# EasyEDA schematic SCHEMATICS.json

## Sheets
1 schem1: TITLE: pcb_busniness card; REV: 1.0; Date: 2024-07-21; Sheet: 1/1; Drawn By: ministermonkeya1; Company: Your Company
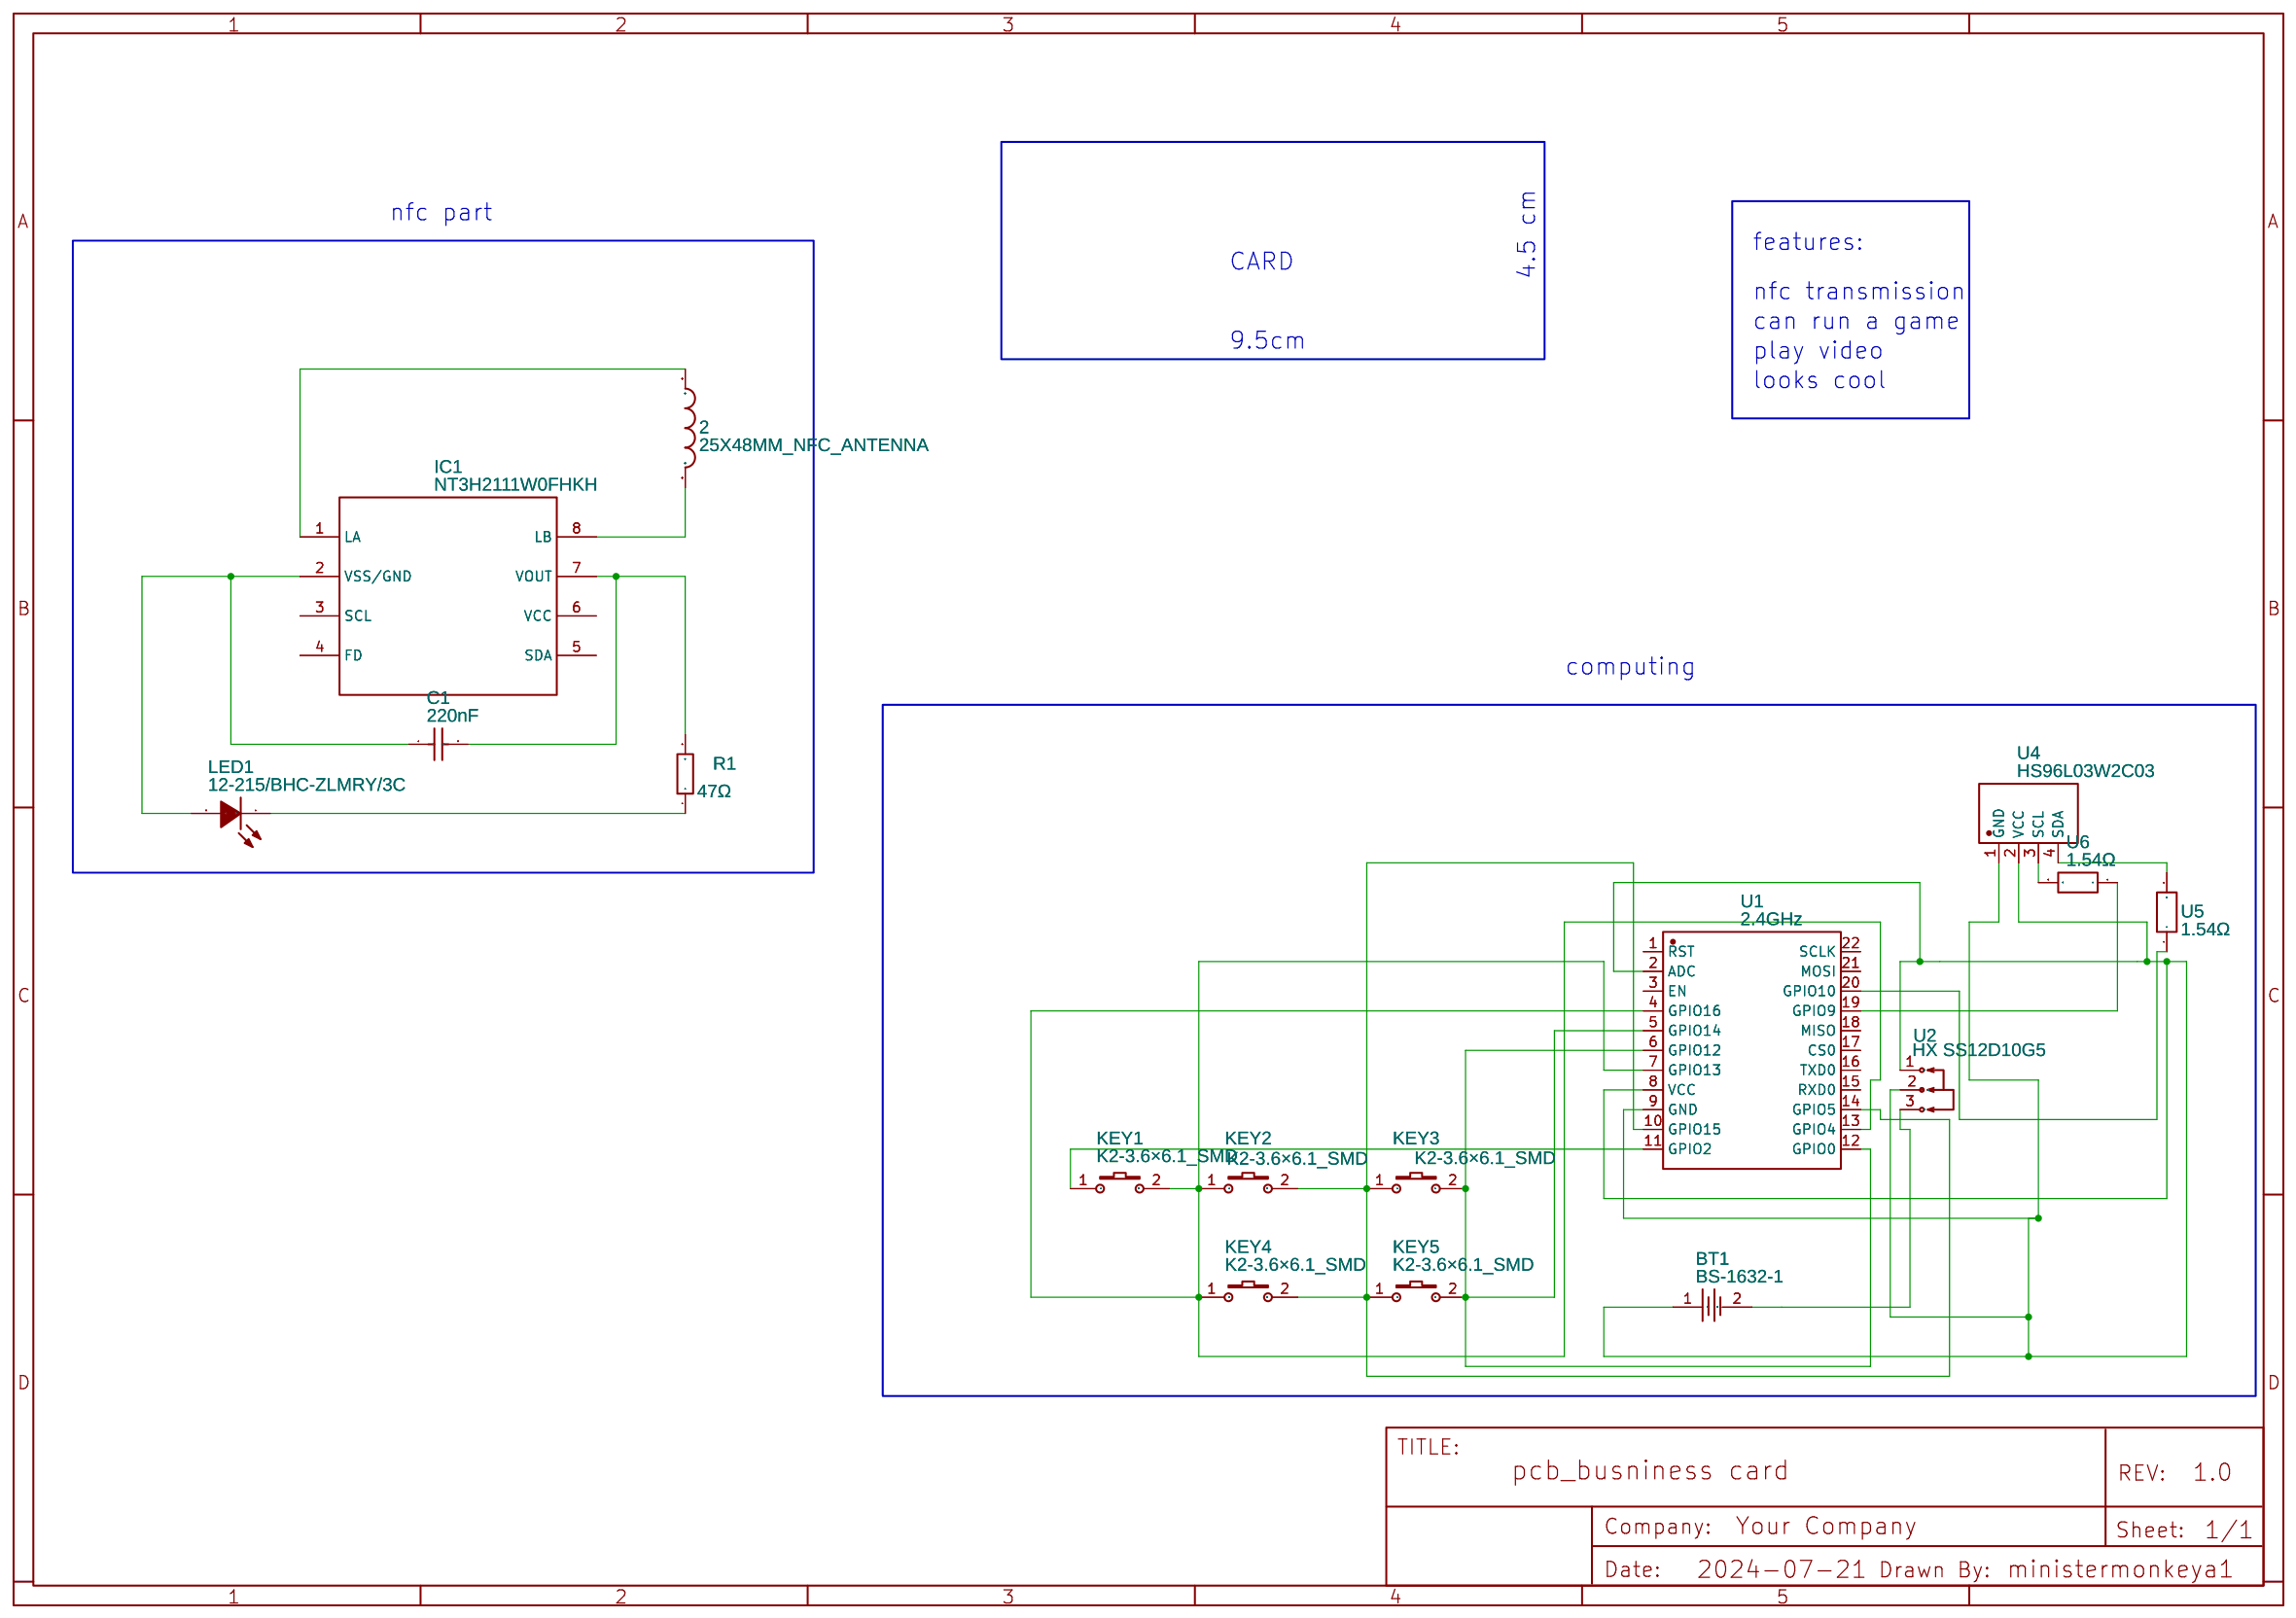
[diagram p0: schem1]
2 schem1 copy
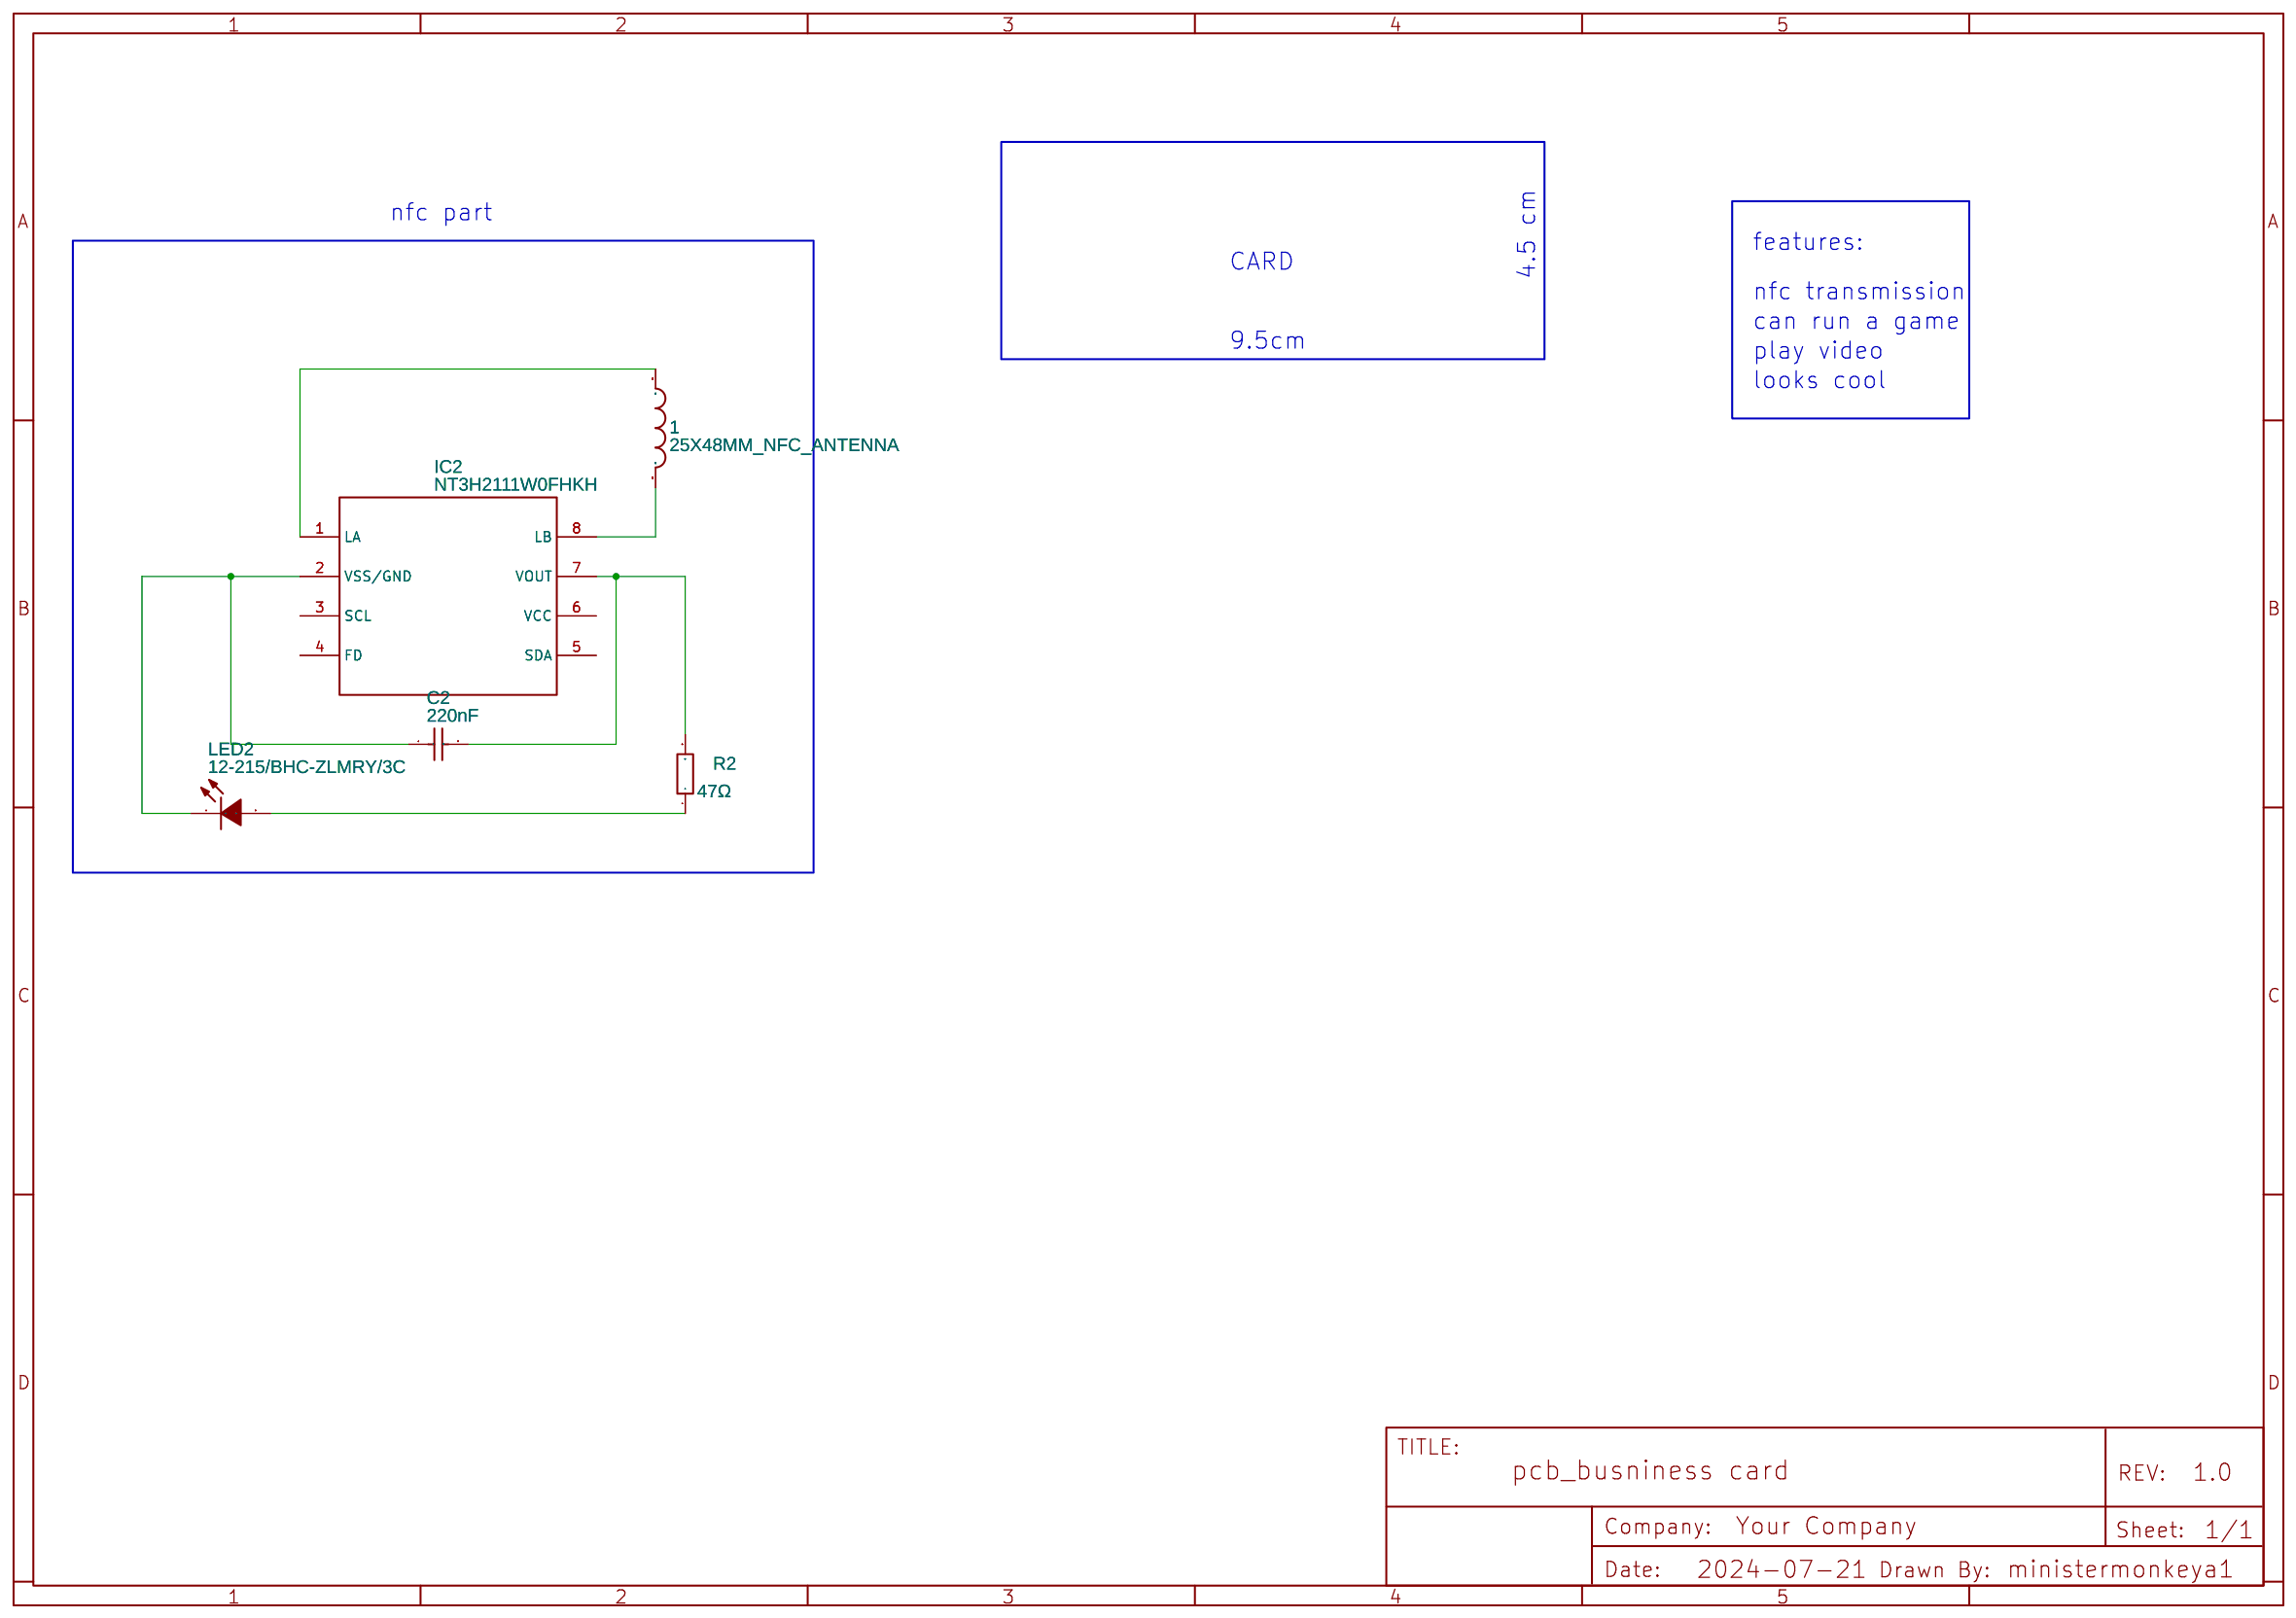
[diagram p1: schem1 copy]

## Parts
sheet schem1 copy
1  25X48MM_NFC_ANTENNA  [25X48MM_NFC_ANTENNA]
C2  220nF  [C0805]
IC2  NT3H2111W0FHKH  [QFN50P160X160X50-8N]
LED2  12-215/BHC-ZLMRY/3C  [LED-SMD_L2.1-W1.0-RD_BLUE]
R2  47Ω  [R0603]
sheet schem1
2  25X48MM_NFC_ANTENNA  [25X48MM_NFC_ANTENNA]
BT1  BS-1632-1  [BAT-SMD_BS-1632-1]
C1  220nF  [C0805]
IC1  NT3H2111W0FHKH  [QFN50P160X160X50-8N]
KEY1  K2-3.6×6.1_SMD  [KEY-SMD_2P-L6.2-W3.6-LS8.0]
KEY2  K2-3.6×6.1_SMD  [KEY-SMD_2P-L6.2-W3.6-LS8.0]
KEY3  K2-3.6×6.1_SMD  [KEY-SMD_2P-L6.2-W3.6-LS8.0]
KEY4  K2-3.6×6.1_SMD  [KEY-SMD_2P-L6.2-W3.6-LS8.0]
KEY5  K2-3.6×6.1_SMD  [KEY-SMD_2P-L6.2-W3.6-LS8.0]
LED1  12-215/BHC-ZLMRY/3C  [LED-SMD_L2.1-W1.0-RD_BLUE]
R1  47Ω  [R0603]
U1  2.4GHz  [WIFIM-SMD_ESP-12F-ESP8266MOD]
U2  HX SS12D10G5  [SW-TH_3P-P4.80-HX-SS12D10G4]
U4  HS96L03W2C03  [OLED-TH_L27.8-W27.2-P2.54_C9900033791]
U5  1.54Ω  [RES-TH_BD1.9-L3.4-P7.40-D0.5]
U6  1.54Ω  [RES-TH_BD1.9-L3.4-P7.40-D0.5]

## Library data of the parts
1 = 25X48MM_NFC_ANTENNA: Contributor: dnonoo
C1 C2 = C2012X7R1E224KT0H0N: Supplier: LCSC; Manufacturer: TDK; Supplier Part: C76640; JLCPCB Part Class: Extended Part
IC1 IC2 = NT3H2111W0FHKH: Contributor: Gerriko io; Supplier: LCSC; Manufacturer: NXP(恩智浦); Supplier Part: C710403
LED1 LED2 = 12-215/BHC-ZLMRY/3C: Supplier: LCSC; Manufacturer: EVERLIGHT(亿光); Supplier Part: C61217; JLCPCB Part Class: Extended Part
R1 R2 = 0603WAF470JT5E: Supplier: LCSC; Manufacturer: UNI-ROYAL(厚声); Supplier Part: C23182; JLCPCB Part Class: Basic Part
2 = 25X48MM_NFC_ANTENNA: Contributor: maggie.j.liu
BT1 = BS-1632-1: Contributor: LCSC; Supplier: LCSC; Supplier Part: C969910; Manufacturer: Q&J; JLCPCB Part Class: Extended Part
KEY1-KEY5 = K2-3.6×6.1_SMD: Supplier Part: C118141; Supplier: LCSC; Manufacturer Part: K2-1107ST-A4SW-06; Contributor: LCEDA_Lib; 制造商: 韩国韩荣
U1 = ESP-12F(ESP8266MOD): Supplier: LCSC; Manufacturer: Ai-Thinker(安信可); Supplier Part: C82891; JLCPCB Part Class: Extended Part
U2 = HX SS12D10G5: Supplier: LCSC; Supplier Part: C19189120; Manufacturer: hanxia(韩下); Contributor: lcsc
U4 = HS96L03W2C03: Contributor: lcsc; Supplier: LCSC; Supplier Part: C5248080; Manufacturer: HS(汉昇); JLCPCB Part Class: Extended Part
U5 U6 = MF0204FRE52-1R54: Contributor: lcsc; Supplier: LCSC; Supplier Part: C1751043; Manufacturer: YAGEO(国巨); JLCPCB Part Class: Extended Part

## Nets
Net-(1-P$1): 1.P$1 IC2.1(LA)
Net-(1-P$2): 1.P$2 IC2.8(LB)
Net-(2-P$1): 2.P$1 IC1.1(LA)
Net-(2-P$2): 2.P$2 IC1.8(LB)
Net-(BT1-1): BT1.1 U1.2(ADC) U1.8(VCC) U1.9(GND) U2.1 U2.2 U4.1(GND) U4.2(VCC)
Net-(BT1-2): BT1.2 U2.3
Net-(C1-1): C1.1 IC1.2(VSS/GND) LED1.2(A)
Net-(C1-2): C1.2 IC1.7(VOUT) R1.2
Net-(C2-1): C2.1 IC2.2(VSS/GND) LED2.1(K)
Net-(C2-2): C2.2 IC2.7(VOUT) R2.2
Net-(KEY1-1): KEY1.1 U1.11(GPIO2)
Net-(KEY1-2): KEY1.2 KEY2.1 KEY4.1 U1.4(GPIO16) U1.7(GPIO13) U1.13(GPIO4)
Net-(KEY2-2): KEY2.2 KEY3.1 KEY4.2 KEY5.1 U1.10(GPIO15) U1.14(GPIO5)
Net-(KEY3-2): KEY3.2 KEY5.2 U1.5(GPIO14) U1.6(GPIO12) U1.12(GPIO0)
Net-(LED1-1): LED1.1(K) R1.1
Net-(LED2-2): LED2.2(A) R2.1
Net-(U1-19): U1.19(GPIO9) U6.1
Net-(U1-20): U1.20(GPIO10) U5.1
Net-(U4-3): U4.3(SCL) U6.2
Net-(U4-4): U4.4(SDA) U5.2

Not connected (* = marked no-connect by the designer): IC1 3(SCL) 4(FD) 5(SDA) 6(VCC); IC2 3(SCL) 4(FD) 5(SDA) 6(VCC); U1 1(RST) 3(EN) 15(RXD0) 16(TXD0) 17(CS0) 18(MISO) 21(MOSI) 22(SCLK)

## Notes on the sheets
sheet 1
- nfc part
- features:
- CARD
- 4.5 cm
- nfc transmission
- can run a game
- 9.5cm
- play video
- looks cool
- computing
sheet 2
- nfc part
- features:
- CARD
- 4.5 cm
- nfc transmission
- can run a game
- 9.5cm
- play video
- looks cool
